# Altium schematic sheet Wi-Fi.SchDoc
size A3; SheetNumber: 4; SheetTotal: 10
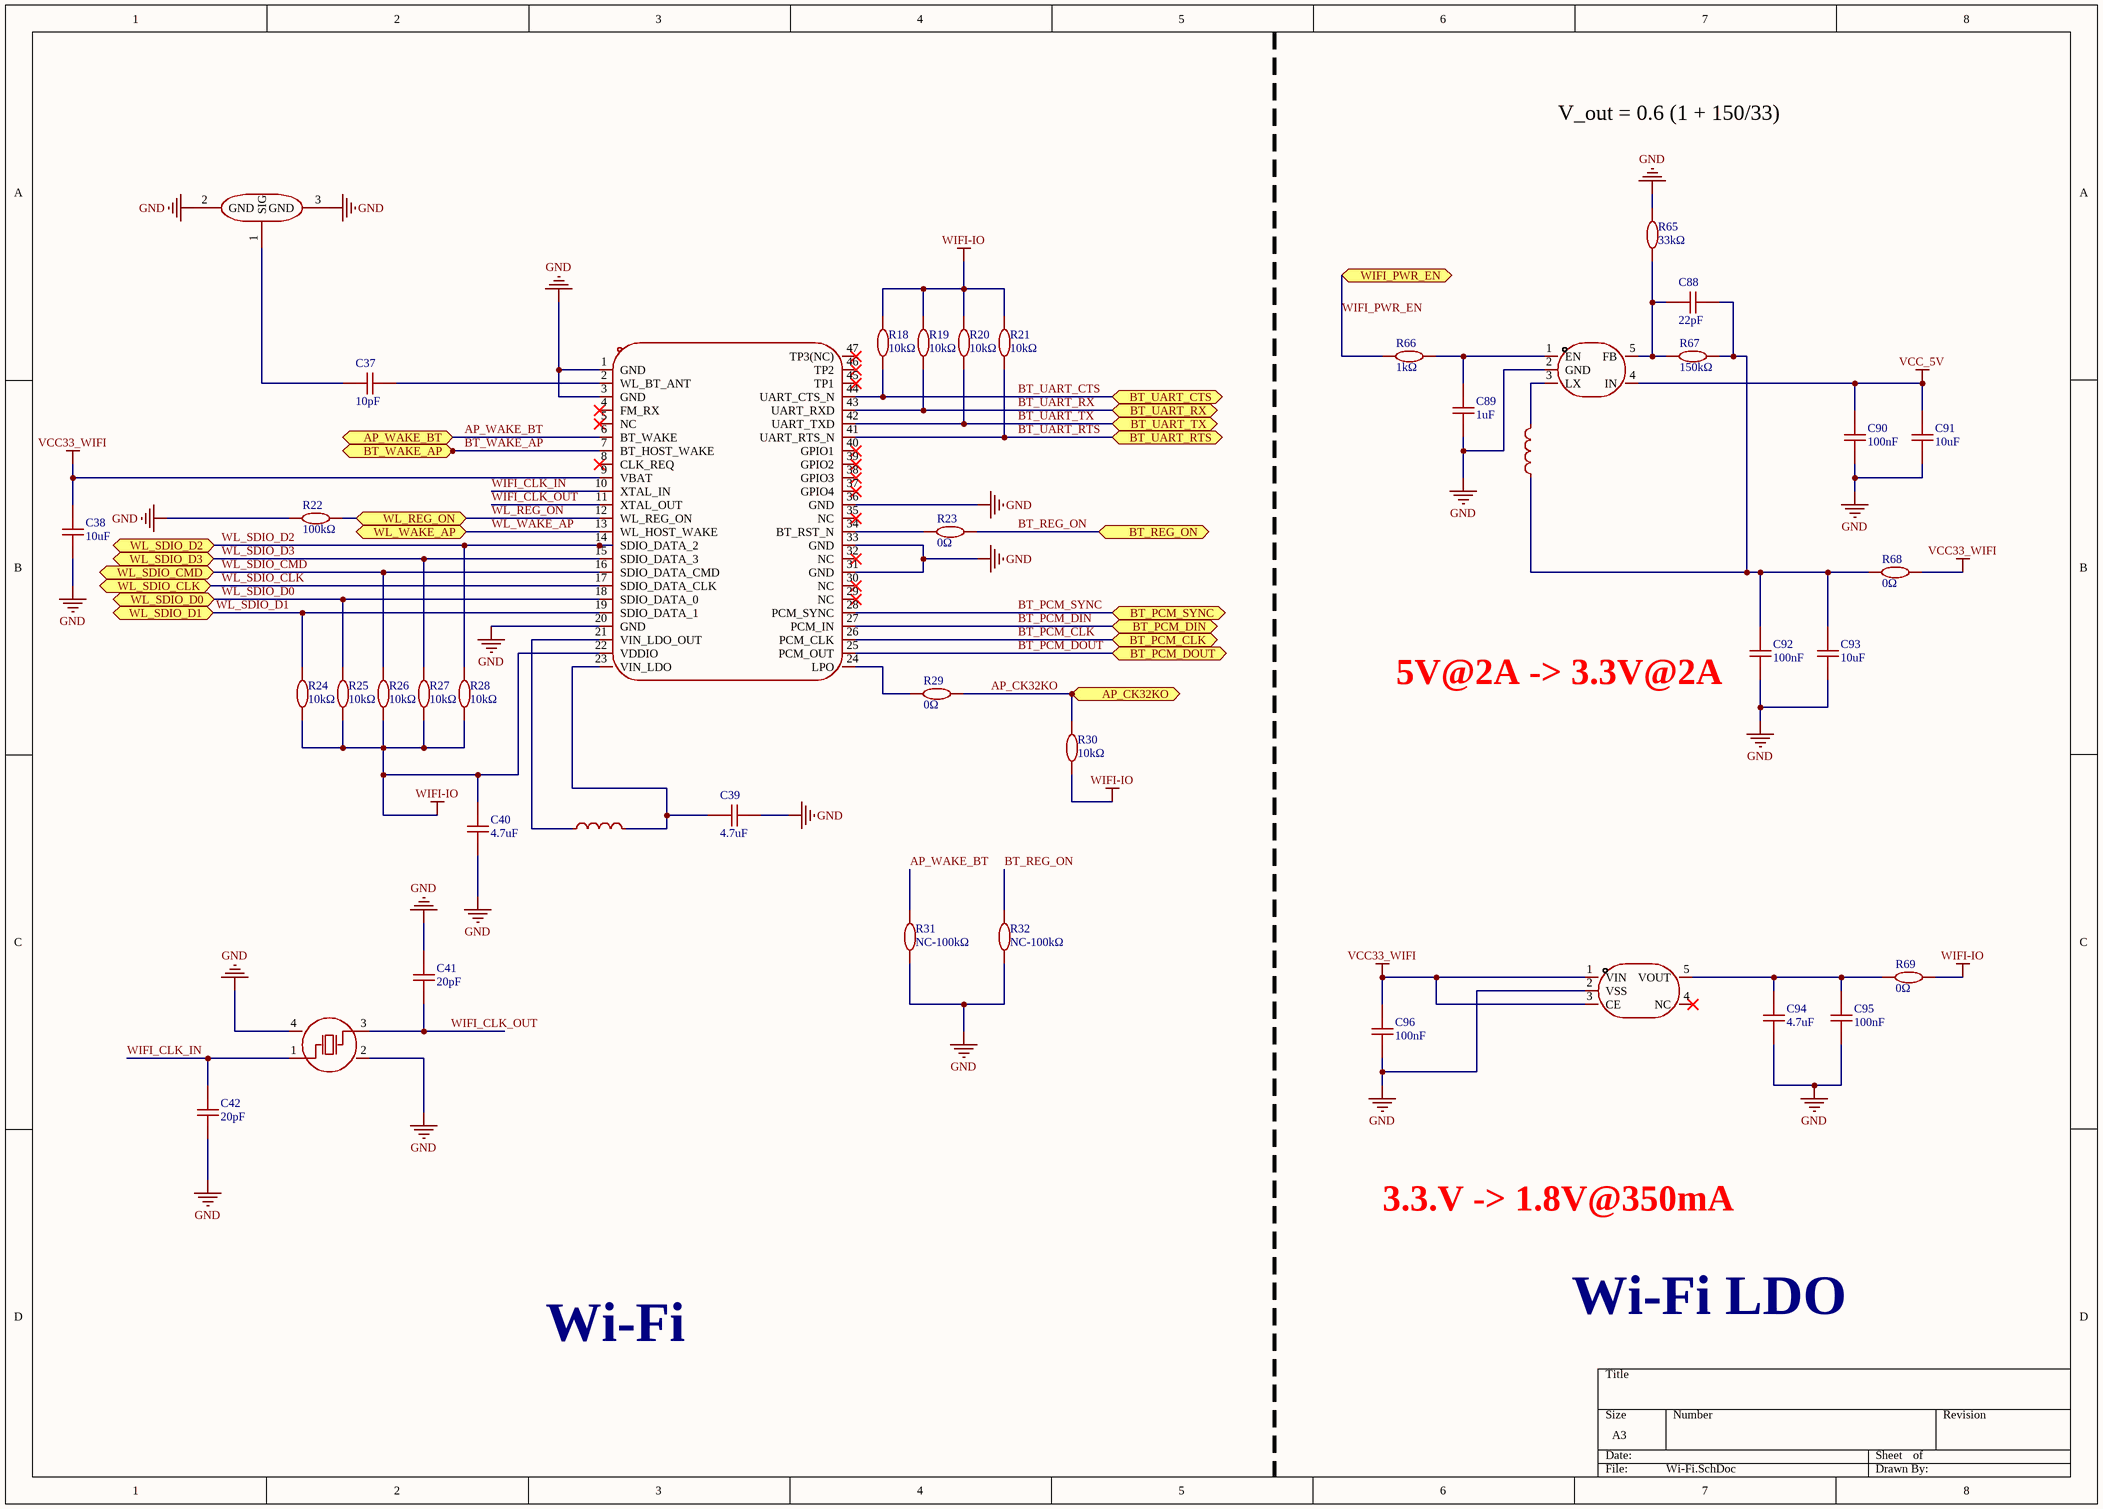
[diagram p0: Wi-Fi.SchDoc]

## Parts
C37  10pF  [C0402]
C38  10uF  [C0603]
C39  4.7uF  [C0402]
C40  4.7uF  [C0402]
C41  20pF  [C0402]
C42  20pF  [C0402]
C88  22pF  [C0402]
C89  1uF  [C0402]
C90  100nF  [C0402]
C91  10uF  [C0603]
C92  100nF  [C0402]
C93  10uF  [C0603]
C94  4.7uF  [C0402]
C95  100nF  [C0402]
C96  100nF  [C0402]
JP1  6GHz  [RF-SMD_FRF05002-JSS103M]  (value not drawn)
L1  4.7uH  [IND-SMD_L6.0-W6.0_FNR60XXS]  (value not drawn)
L7  4.7uH  [IND-SMD_L6.0-W6.0_FNR60XXS]  (value not drawn)
R18  10kΩ  [R0402]
R19  10kΩ  [R0402]
R20  10kΩ  [R0402]
R21  10kΩ  [R0402]
R22  100kΩ  [R0402]
R23  0Ω  [R0402]
R24  10kΩ  [R0402]
R25  10kΩ  [R0402]
R26  10kΩ  [R0402]
R27  10kΩ  [R0402]
R28  10kΩ  [R0402]
R29  0Ω  [R0402]
R30  10kΩ  [R0402]
R31  NC-100kΩ  [R0402]
R32  NC-100kΩ  [R0402]
R65  33kΩ  [R0402]
R66  1kΩ  [R0402]
R67  150kΩ  [R0402]
R68  0Ω  [R0402]
R69  0Ω  [R0402]
U6  2.4GHz  [QFN-44_L12.0-W12.0-P0.90-TL_AP6212]  (value not drawn)
U30  SY8089A1AAC  [TSOT-23-5_L2.9-W1.6-P0.95-LS2.8-BR]  (value not drawn)
U31  ME6212C18M5G  [SOT-23-5_L3.0-W1.7-P0.95-LS2.8-BL]  (value not drawn)
X1  26MHz  [CRYSTAL-SMD_4P-L3.2-W2.5-BL]  (value not drawn)

## Ports
AP_CK32KO (bidir, see SoC_2[4B]), AP_WAKE_BT (bidir, see SoC_1[6C]), BT_PCM_CLK (bidir, see SoC_1[6B]), BT_PCM_DIN (bidir, see SoC_1[6B]), BT_PCM_DOUT (bidir, see SoC_1[6B]), BT_PCM_SYNC (bidir, see SoC_1[6B]), BT_REG_ON (bidir, see SoC_1[6C]), BT_UART_CTS (bidir, see SoC_1[6B]), BT_UART_RTS (bidir, see SoC_1[6B]), BT_UART_RX (bidir, see SoC_1[6B]), BT_UART_TX (bidir, see SoC_1[6B]), BT_WAKE_AP (bidir, see SoC_1[6C]), WIFI_PWR_EN (bidir, see SoC_1[6B]), WL_REG_ON (bidir, see SoC_1[6C]), WL_SDIO_CLK (bidir, see SoC_1[7B]), WL_SDIO_CMD (bidir, see SoC_1[6B]), WL_SDIO_D0 (bidir, see SoC_1[6B]), WL_SDIO_D1 (bidir, see SoC_1[6B]), WL_SDIO_D2 (bidir, see SoC_1[6B]), WL_SDIO_D3 (bidir, see SoC_1[6B]), WL_WAKE_AP (bidir, see SoC_1[6C])

## Nets
GND: C38.1 C39.2 C40.1 C41.2 C42.1 C89.1 C90.1 C91.1 C92.1 C93.1 C94.1 C95.1 C96.1 JP1.2(GND) JP1.3(GND) R22.1 R31.1 R32.1 R65.2 U6.1(GND) U6.3(GND) U6.20(GND) U6.31(GND) U6.33(GND) U6.36(GND) U30.2(GND) U31.2(VSS) X1.2(GND) X1.4(GND)
VCC33_WIFI: C38.2 C96.2 R68.2 U6.9(VBAT) U31.1(VIN) U31.3(CE)
VCC_5V: C90.2 C91.2 U30.4(IN)
WIFI-IO: C40.2 R18.2 R19.2 R20.2 R21.2 R24.1 R25.1 R26.1 R27.1 R28.1 R30.1 R69.2 U6.22(VDDIO)
AP_CK32KO: R29.2 R30.2 ; port AP_CK32KO
AP_WAKE_BT: R31.2 U6.6(BT_WAKE) ; port AP_WAKE_BT
BT_PCM_CLK: U6.26(PCM_CLK) ; port BT_PCM_CLK
BT_PCM_DIN: U6.27(PCM_IN) ; port BT_PCM_DIN
BT_PCM_DOUT: U6.25(PCM_OUT) ; port BT_PCM_DOUT
BT_PCM_SYNC: U6.28(PCM_SYNC) ; port BT_PCM_SYNC
BT_REG_ON: R23.2 R32.2 ; port BT_REG_ON
BT_UART_CTS: R18.1 U6.44(UART_CTS_N) ; port BT_UART_CTS
BT_UART_RTS: R21.1 U6.41(UART_RTS_N) ; port BT_UART_RTS
BT_UART_RX: R19.1 U6.43(UART_RXD) ; port BT_UART_RX
BT_UART_TX: R20.1 U6.42(UART_TXD) ; port BT_UART_TX
BT_WAKE_AP: U6.7(BT_HOST_WAKE) ; port BT_WAKE_AP
WIFI_CLK_IN: C42.2 U6.10(XTAL_IN) X1.1(OSC1)
WIFI_CLK_OUT: C41.1 U6.11(XTAL_OUT) X1.3(OSC2)
WIFI_PWR_EN: R66.1 ; port WIFI_PWR_EN
WL_REG_ON: R22.2 U6.12(WL_REG_ON) ; port WL_REG_ON
WL_SDIO_CLK: U6.17(SDIO_DATA_CLK) ; port WL_SDIO_CLK
WL_SDIO_CMD: R26.2 U6.16(SDIO_DATA_CMD) ; port WL_SDIO_CMD
WL_SDIO_D0: R25.2 U6.18(SDIO_DATA_0) ; port WL_SDIO_D0
WL_SDIO_D1: R24.2 U6.19(SDIO_DATA_1) ; port WL_SDIO_D1
WL_SDIO_D2: R28.2 U6.14(SDIO_DATA_2) ; port WL_SDIO_D2
WL_SDIO_D3: R27.2 U6.15(SDIO_DATA_3) ; port WL_SDIO_D3
WL_WAKE_AP: U6.13(WL_HOST_WAKE) ; port WL_WAKE_AP
NetC37_1: C37.1 JP1.1(SIG)
NetC37_2: C37.2 U6.2(WL_BT_ANT)
NetC39_1: C39.1 L1.2 U6.23(VIN_LDO)
NetC88_1: C88.1 R65.1 R67.1 U30.5(FB)
NetC88_2: C88.2 C92.2 C93.2 L7.1 R67.2 R68.1
NetC89_2: C89.2 R66.2 U30.1(EN)
NetC94_2: C94.2 C95.2 R69.1 U31.5(VOUT)
NetL1_1: L1.1 U6.21(VIN_LDO_OUT)
NetL7_2: L7.2 U30.3(LX)
NetR23_1: R23.1 U6.34(BT_RST_N)
NetR29_1: R29.1 U6.24(LPO)

Not connected (* = marked no-connect by the designer): U6 4(FM_RX)* 5(NC)* 8(CLK_REQ)* 29(NC)* 30(NC)* 32(NC)* 35(NC)* 37(GPIO4)* 38(GPIO3)* 39(GPIO2)* 40(GPIO1)* 45(TP1)* 46(TP2)* 47(TP3(NC))*; U31 4(NC)*

## Notes on the sheet
- V_out = 0.6 (1 + 150/33)
- 5V@2A -> 3.3V@2A
- 3.3.V -> 1.8V@350mA
- Wi-Fi LDO
- Wi-Fi

## Library data of the parts
C37 = 10pF: 50V 10pF C0G ±5% 0402 Ceramic Capacitors ROHS
C38 C91 C93 = 10uF: 10V 10uF X5R ±10% 0603 Ceramic Capacitors ROHS
C39 C40 C94 = 4.7uF: 10V 4.7uF X5R ±20% 0402 Ceramic Capacitors ROHS
C41 C42 = 20pF: 50V 20pF NP0 ±5% 0402 Ceramic Capacitors ROHS
C88 = 22pF: 50V 22pF C0G ±5% 0402 Ceramic Capacitors ROHS
C89 = 1uF: 50V 1uF X5R ±10% 0402 Ceramic Capacitors ROHS
C90 C92 C95 C96 = 100nF: 50V 100nF X7R ±10% 0402 Ceramic Capacitors ROHS
JP1 = U.FL-R-SMT-1(80)_C88374: Manufacturer: HRS(广濑); Add into BOM: yes; Connector Type: Board Side; Interface: Male Pin; Number of Ports: 1; Interface Diameter: 2mm; Interface Length/Height: 1.25mm; RF Series: IPEX; Impedance: 50Ω; Symbol: U.FL-R-SMT-1(80); Device: U.FL-R-SMT-1(80)_C88374; LCSC Part Name: IPEX 内针; Supplier Part: C88374; Manufacturer Part: U.FL-R-SMT-1(80); Supplier Footprint: SMD; JLCPCB Part Class: Extended Part; Datasheet: https://item.szlcsc.com/datasheet/U.FL-R-SMT-1(80)/89553.html; Supplier: LCSC; Convert to PCB: yes; Value: 6GHz; Style: -; Operating Temperature Range: -40℃~+90℃
L1 L7 = FNR6020S4R7MT: 2.5A 4.7uH Magnetic Shielded Inductor ±20% 3.6A 75mΩ SMD,6x6mm Fixed Inductors ROHS; Manufacturer: cjiang(长江微电); Add into BOM: yes; Symbol: FNR6020S4R7MT; Device: FNR6020S4R7MT; LCSC Part Name: 4.7uH ±20% 3.6A; Supplier Part: C168008; Manufacturer Part: FNR6020S4R7MT; Supplier Footprint: SMD,6x6mm; JLCPCB Part Class: Extended Part; Datasheet: https://atta.szlcsc.com/upload/public/pdf/source/20190327/C167925_9EFF0AABC4CA629C2CC95961DBF7D39D.pdf; Supplier: LCSC; Convert to PCB: yes; Value: 4.7uH; Tolerance: ±20%; Saturation Current (Isat): 3.6A; DC Resistance (DCR): 75mΩ
R18-R21 R24-R28 R30 = 10kΩ: 62.5mW 10kΩ 50V ±100ppm/℃ Thick Film Resistor ±1% 0402 Chip Resistor - Surface Mount ROHS
R22 R31 R32 = 100kΩ: 100kΩ 62.5mW 50V ±100ppm/℃ Thick Film Resistor ±1% 0402 Chip Resistor - Surface Mount ROHS
R23 R29 R68 R69 = 0Ω: 0Ω 62.5mW 50V Thick Film Resistor ±1% 0402 Chip Resistor - Surface Mount ROHS
R65 = 33kΩ: 62.5mW 33kΩ 50V ±100ppm/℃ Thick Film Resistor ±1% 0402 Chip Resistor - Surface Mount ROHS
R66 = 1kΩ: 1kΩ 62.5mW 50V ±100ppm/℃ Thick Film Resistor ±1% 0402 Chip Resistor - Surface Mount ROHS
R67 = 150kΩ: 62.5mW 150kΩ 50V ±100ppm/℃ Thick Film Resistor ±1% 0402 Chip Resistor - Surface Mount ROHS
U6 = AP6212: 2.4GHz -90dBm QFN-44(12x12) RF Transceiver Modules and Modems ROHS; Manufacturer: AMPAK(正基科技); Add into BOM: yes; Interface Type: On-board PCB antenna; Output Power: 16dBm; Symbol: AP6212; Device: AP6212; LCSC Part Name: AP6212; Supplier Part: C2798300; Manufacturer Part: AP6212; Supplier Footprint: QFN-44(12x12); JLCPCB Part Class: Extended Part; Datasheet: https://item.szlcsc.com/datasheet/AP6212/2941698.html; Supplier: LCSC; Convert to PCB: yes; Utilized IC / Part: -; Wireless Standard: -; Value: 2.4GHz; Antenna Type: -; Voltage - Supply: -; Receive  Current: -; Send  Current: -; Sensitivity: -90dBm; Operating Temperature: -30℃~+85℃
U30 = SY8089A1AAC: 1.5MHz Buck 2A Adjustable 1 SOT-23-5 Voltage Regulators - DC DC Switching Regulators ROHS; Manufacturer: Silergy(矽力杰); Add into BOM: yes; Voltage - Supply: 2.5V~5.5V; Number of Outputs: 1; Quiescent Current: 50uA; Switch tube (built-in/external): Built-In; Symbol: SY8089A1AAC; Device: SY8089A1AAC; LCSC Part Name: 高效1.5MHz 2A同步降压调节器; Supplier Part: C479074; Manufacturer Part: SY8089A1AAC; Supplier Footprint: SOT-23-5; JLCPCB Part Class: Extended Part; Datasheet: https://item.szlcsc.com/datasheet/SY8089A1AAC/486366.html; Supplier: LCSC; Convert to PCB: yes; Function: Buck; Output Voltage: -; Output Current: 2A; Frequency - Switching: 1.5MHz; Operating Temperature: -40℃~+125℃@(TA/TJ); Synchronous Rectifier: Yes; Topology: Buck; Output Type: Adjustable
U31 = ME6212C18M5G: 65dB@(1kHz) Positive Fixed 1.8V SOT-23-5 Voltage Regulators - Linear, Low Drop Out (LDO) Regulators ROHS; Manufacturer: MICRONE(南京微盟); Add into BOM: yes; Voltage - Supply: 6V; Output Current: 350mA; Voltage Dropout: 200mV@(100mA); standby current: 50uA; Noise: 50uVrms; Number of Outputs: 1; Symbol: ME6212C18M5G; Device: ME6212C18M5G; LCSC Part Name: 输入6V 输出1.8V 250mA; Supplier Part: C236669; Manufacturer Part: ME6212C18M5G; Supplier Footprint: SOT-23-5; JLCPCB Part Class: Extended Part; Datasheet: https://item.szlcsc.com/datasheet/ME6212C18M5G/236109.html; Supplier: LCSC; Convert to PCB: yes; Output Type: Fixed; Output Voltage: 1.8V; Power Supply Rejection Ratio (PSRR): 65dB@(1kHz); Features: Enable; Operating Temperature: -40℃~+150℃@(Ta); Output Configuration: Positive
X1 = TAXM26M4RLBCCT2T: Crystal Oscillator 20pF SMD3225-4P Crystals ROHS; Manufacturer: YJX(雅晶鑫); Symbol: SMD-3225_4P26MHZ20PF10PPM-40~+85℃; Add into BOM: yes; Normal temperature Frequency Tolerance: ±10ppm; Frequency Stability: ±50ppm; Equivalent Series Resistance(ESR): 80Ω; Device: TAXM26M4RLBCCT2T; LCSC Part Name: 26MHz ±10ppm 20pF; Supplier Part: C164050; Manufacturer Part: TAXM26M4RLBCCT2T; Supplier Footprint: SMD3225-4P; JLCPCB Part Class: Extended Part; Datasheet: https://item.szlcsc.com/datasheet/TAXM26M4RLBCCT2T/175432.html; Supplier: LCSC; Convert to PCB: yes; Type: Crystal Oscillator; Value: 26MHz; Load Capacitance: 20pF; Operating Temperature: -40℃~+85℃